# Altium schematic sheet Solder Training Tier 1.SchDoc
size A; SheetNumber: 1; SheetTotal: 1
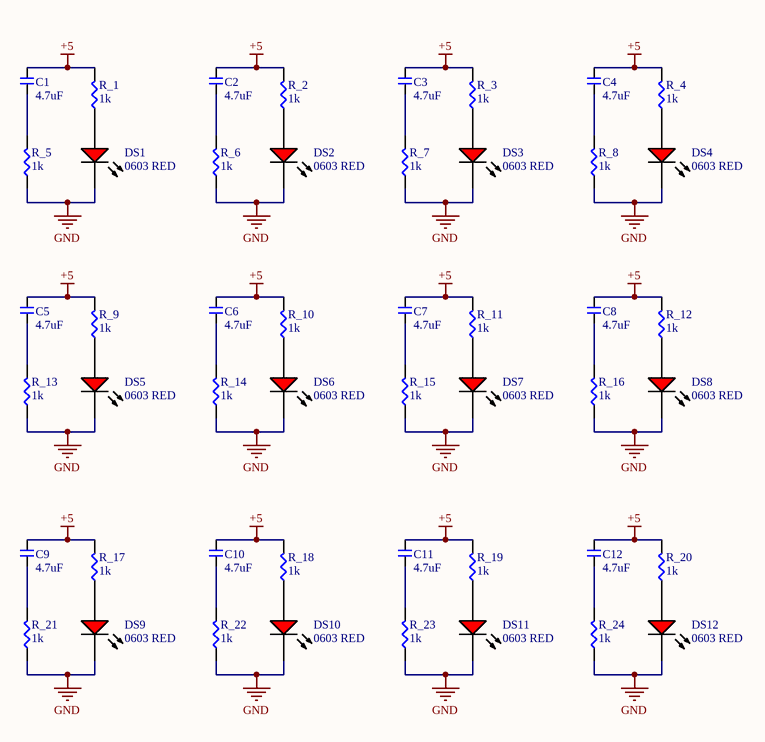
[diagram p0: Solder Training Tier 1.SchDoc]

## Parts
C1  4.7uF  [CAP-0603]
C2  4.7uF  [CAP-0603]
C3  4.7uF  [CAP-0603]
C4  4.7uF  [CAP-0603]
C5  4.7uF  [CAP-0603]
C6  4.7uF  [CAP-0603]
C7  4.7uF  [CAP-0603]
C8  4.7uF  [CAP-0603]
C9  4.7uF  [CAP-0603]
C10  4.7uF  [CAP-0603]
C11  4.7uF  [CAP-0603]
C12  4.7uF  [CAP-0603]
DS1  0603 RED  [VISH-TLMX1100_V]
DS2  0603 RED  [VISH-TLMX1100_V]
DS3  0603 RED  [VISH-TLMX1100_V]
DS4  0603 RED  [VISH-TLMX1100_V]
DS5  0603 RED  [VISH-TLMX1100_V]
DS6  0603 RED  [VISH-TLMX1100_V]
DS7  0603 RED  [VISH-TLMX1100_V]
DS8  0603 RED  [VISH-TLMX1100_V]
DS9  0603 RED  [VISH-TLMX1100_V]
DS10  0603 RED  [VISH-TLMX1100_V]
DS11  0603 RED  [VISH-TLMX1100_V]
DS12  0603 RED  [VISH-TLMX1100_V]
R_1  1k  [RES-0603]
R_2  1k  [RES-0603]
R_3  1k  [RES-0603]
R_4  1k  [RES-0603]
R_5  1k  [RES-0603]
R_6  1k  [RES-0603]
R_7  1k  [RES-0603]
R_8  1k  [RES-0603]
R_9  1k  [RES-0603]
R_10  1k  [RES-0603]
R_11  1k  [RES-0603]
R_12  1k  [RES-0603]
R_13  1k  [RES-0603]
R_14  1k  [RES-0603]
R_15  1k  [RES-0603]
R_16  1k  [RES-0603]
R_17  1k  [RES-0603]
R_18  1k  [RES-0603]
R_19  1k  [RES-0603]
R_20  1k  [RES-0603]
R_21  1k  [RES-0603]
R_22  1k  [RES-0603]
R_23  1k  [RES-0603]
R_24  1k  [RES-0603]

## Nets
+5: C1.2 C2.2 C3.2 C4.2 C5.2 C6.2 C7.2 C8.2 C9.2 C10.2 C11.2 C12.2 R_1.2 R_2.2 R_3.2 R_4.2 R_9.2 R_10.2 R_11.2 R_12.2 R_17.2 R_18.2 R_19.2 R_20.2
GND: DS1.2(K) DS2.2(K) DS3.2(K) DS4.2(K) DS5.2(K) DS6.2(K) DS7.2(K) DS8.2(K) DS9.2(K) DS10.2(K) DS11.2(K) DS12.2(K) R_5.1 R_6.1 R_7.1 R_8.1 R_13.1 R_14.1 R_15.1 R_16.1 R_21.1 R_22.1 R_23.1 R_24.1
NetC1_1: C1.1 R_5.2
NetC2_1: C2.1 R_6.2
NetC3_1: C3.1 R_7.2
NetC4_1: C4.1 R_8.2
NetC5_1: C5.1 R_13.2
NetC6_1: C6.1 R_14.2
NetC7_1: C7.1 R_15.2
NetC8_1: C8.1 R_16.2
NetC9_1: C9.1 R_21.2
NetC10_1: C10.1 R_22.2
NetC11_1: C11.1 R_23.2
NetC12_1: C12.1 R_24.2
NetDS1_1: DS1.1(A) R_1.1
NetDS2_1: DS2.1(A) R_2.1
NetDS3_1: DS3.1(A) R_3.1
NetDS4_1: DS4.1(A) R_4.1
NetDS5_1: DS5.1(A) R_9.1
NetDS6_1: DS6.1(A) R_10.1
NetDS7_1: DS7.1(A) R_11.1
NetDS8_1: DS8.1(A) R_12.1
NetDS9_1: DS9.1(A) R_17.1
NetDS10_1: DS10.1(A) R_18.1
NetDS11_1: DS11.1(A) R_19.1
NetDS12_1: DS12.1(A) R_20.1

## Library data of the parts
C1-C12 = CMP-009-000303-1: Source: ife19_Elec_Library.SchLib; Design Item ID: CAP-0603
DS1-DS12 = CMP-1666-00027-1: LED, RED, 2.1 V, -40 to 100 degC, 2-Pin SMD (0603), RoHS, Tape and Reel; Type (Capacitors): C0G; Resistance: 100000000000 Ohm; Capacitance: 12 pF; Voltage Rating: 50 V; Tolerance: 5%; Min Operating Temperature: -55degC; REACH SVHC: No SVHC; ComponentLink2Description: Datasheet; ComponentLink1URL: http://www.vishay.com/; Width: 0.8 mm; Package Quantity: 4000; PackageReference: TLMX1100; ComponentLink2URL: http://www.vishay.com/docs/83173/tlmb1100.pdf; Case/Package: 0603; Case Code (Metric): 1608; Packaging: Tape and Reel; Pins: 2; ComponentLink1Description: Manufacturer URL; Max Operating Temperature: 125degC; Height: 0.8 mm; Length: 1.6 mm; Mount: Surface Mount; PackageDescription: 2-Pin Surface Mount Device, Body 1.6 x 0.8 mm; DatasheetVersion: Rev. 2.7, 03/2016; Case Code (Imperial): 0603; Voltage Rating (DC): 50 V; RoHSCompliant: True; Radiation Hardening: No
R_1-R_4 R_9-R_12 R_17-R_20 = CMP-008-000136-1: Source: ife19_Elec_Library.SchLib; Design Item ID: RES-0603
R_5-R_8 R_13-R_16 R_21-R_24 = CMP-010-000003-1: Design Item ID: RES-0603; Source: ife19_Elec_Library.SchLib